# Altium schematic sheet Microcontroller.SchDoc: IMU Design
size A4; DrawnBy: Townsville Group 6; Revision: Final Submission; SheetNumber: 2; SheetTotal: 2
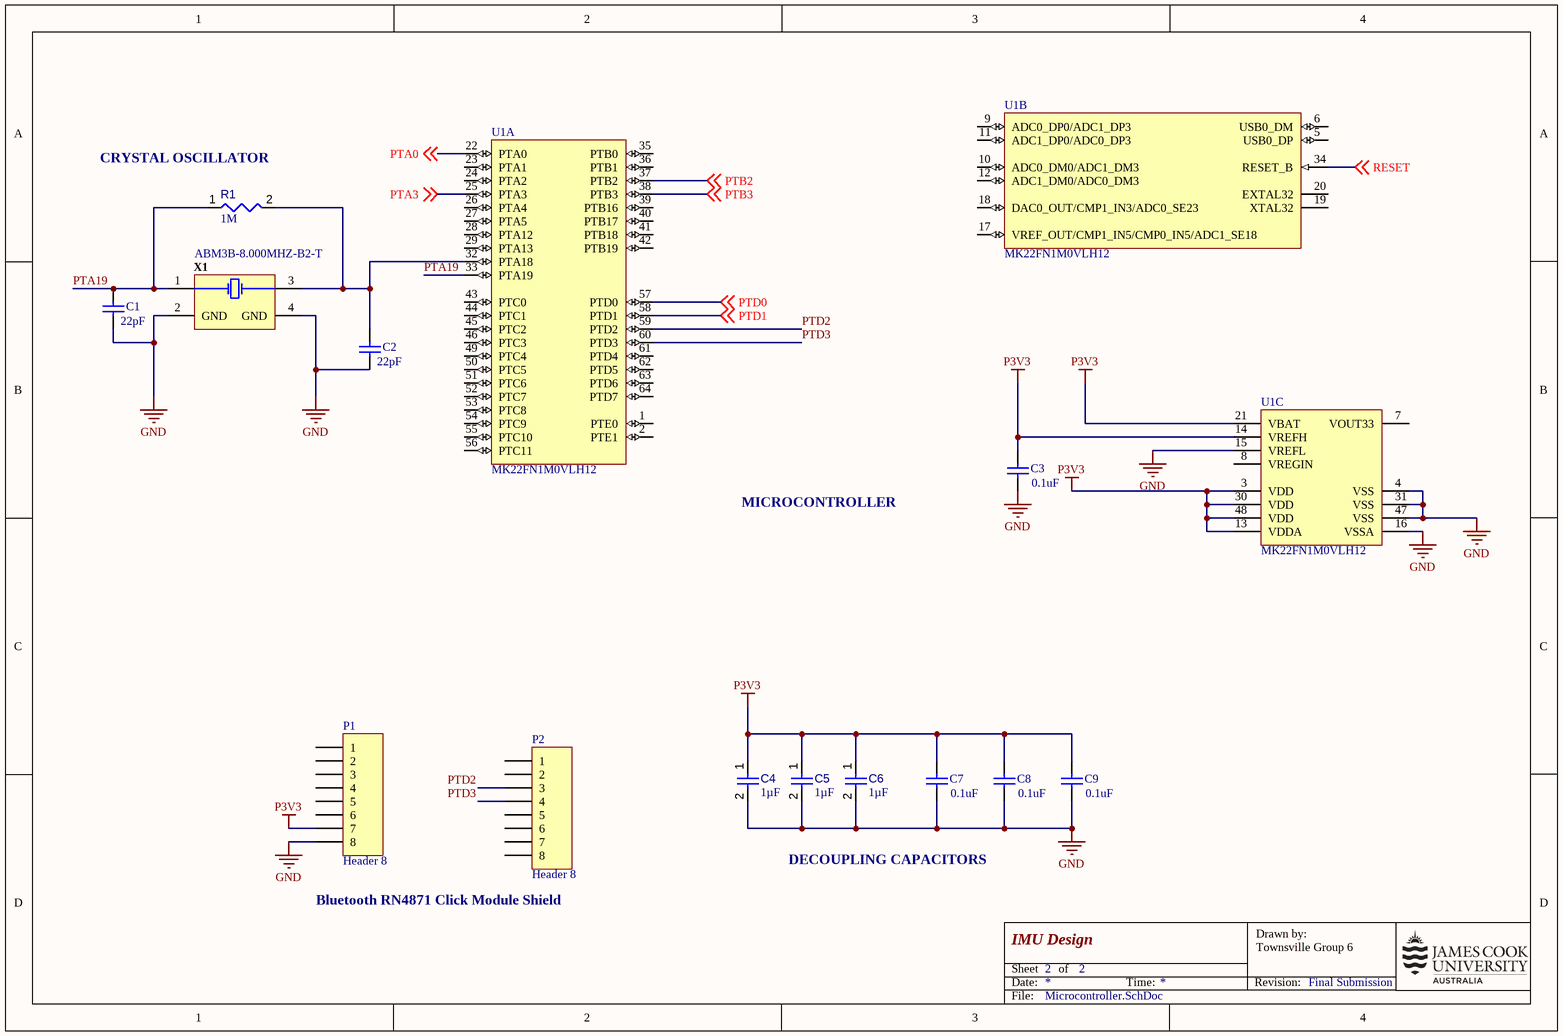
[diagram p0: Microcontroller.SchDoc]

## Parts
C1  22pF  [CAPC1206(3216)100_N]
C2  22pF  [CAPC1206(3216)100_N]
C3  0.1uF  [CAPC3216X95X55NL15T25]
C4  value 1µF  [CAPC3216X180X20ML20]  (hidden comment: Capacitor 1 uF +/- 10% 25 V 1206)
C5  value 1µF  [CAPC3216X180X20ML20]  (hidden comment: Capacitor 1 uF +/- 10% 25 V 1206)
C6  value 1µF  [CAPC3216X180X20ML20]  (hidden comment: Capacitor 1 uF +/- 10% 25 V 1206)
C7  0.1uF  [CAPC3216X95X55NL15T25]
C8  0.1uF  [CAPC3216X95X55NL15T25]
C9  0.1uF  [CAPC3216X95X55NL15T25]
P1  Header 8  [HDR1X8]
P2  Header 8  [HDR1X8]
R1  value 1M  [RESA60-630X240]  (hidden comment: MFR-25FBF52-1M)
U1  MK22FN1M0VLH12  [FREE-LQFP-64_M]  (parts A,B,C of 3)
X1  ABM3B-8.000MHZ-B2-T  [ABRA-ABM3B_V]

## Nets
GND: C1.1 C2.1 C3.2 C4.2 C5.2 C6.2 C7.1 C8.2 C9.2 P1.8 U1.4(VSS) U1.15(VREFL) U1.16(VSSA) U1.31(VSS) U1.47(VSS) X1.2(GND) X1.4(GND)
P3V3: C3.1 C4.1 C5.1 C6.1 C7.2 C8.1 C9.1 P1.7 U1.3(VDD) U1.13(VDDA) U1.14(VREFH) U1.21(VBAT) U1.30(VDD) U1.48(VDD)
PTA0: U1.22(PTA0) ; off-sheet PTA0
PTA3: U1.25(PTA3) ; off-sheet PTA3
PTA19: C1.2 R1.1 U1.33(PTA19) X1.1(X1)
PTB2: U1.37(PTB2) ; off-sheet PTB2
PTB3: U1.38(PTB3) ; off-sheet PTB3
PTD0: U1.57(PTD0) ; off-sheet PTD0
PTD1: U1.58(PTD1) ; off-sheet PTD1
PTD2: P2.3 U1.59(PTD2)
PTD3: P2.4 U1.60(PTD3)
RESET: U1.34(RESET_B) ; off-sheet RESET
NetC2_2: C2.2 R1.2 U1.32(PTA18) X1.3(X2)

Not connected (* = marked no-connect by the designer): P1 1 2 3 4 5 6; P2 1 2 5 6 7 8; U1 1(PTE0) 2(PTE1) 5(USB0_DP) 6(USB0_DM) 7(VOUT33) 8(VREGIN) 9(ADC0_DP0/ADC1_DP3) 10(ADC0_DM0/ADC1_DM3) 11(ADC1_DP0/ADC0_DP3) 12(ADC1_DM0/ADC0_DM3) 17(VREF_OUT/CMP1_IN5/CMP0_IN5/ADC1_SE18) 18(DAC0_OUT/CMP1_IN3/ADC0_SE23) 19(XTAL32) 20(EXTAL32) 23(PTA1) 24(PTA2) 26(PTA4) 27(PTA5) 28(PTA12) 29(PTA13) 35(PTB0) 36(PTB1) 39(PTB16) 40(PTB17) 41(PTB18) 42(PTB19) 43(PTC0) 44(PTC1) 45(PTC2) 46(PTC3) 49(PTC4) 50(PTC5) 51(PTC6) 52(PTC7) 53(PTC8) 54(PTC9) 55(PTC10) 56(PTC11) 61(PTD4) 62(PTD5) 63(PTD6) 64(PTD7)

## Notes on the sheet
- (near R1) CRYSTAL OSCILLATOR
- MICROCONTROLLER
- Bluetooth RN4871 Click Module Shield
- DECOUPLING CAPACITORS
- Date:
- Sheet
- of
- Time:
- Revision:
- Drawn by:
- File:

## Library data of the parts
C1 C2 = CMP-1037-00973-1: CAP 22pF 50V ±1% 1206 (3216 Metric) Thickness 1mm SMD; Tolerance: Â±1%; Case-Metric: 3216; Case-EIA: 1206; Technology: SMT; Rated Voltage: 50 V; Max Thickness: 1 mm; Value: 22pF
C3 C7-C9 = CMP-1662-00007-4: Chip Capacitor, 0.1 uF, +/- 10%, 50 V, -55 to 125 degC, 1206 (3216 Metric), RoHS, Tape and Reel; Manufacturer: Murata; Voltage Rating: 50 V; Lead Pitch: 4 mm; PackageDescription: 2-Pin Surface Mount Device, Body 3.2 x 1.6 mm; DatasheetVersion: 03/2016; Min Operating Temperature: -55 degC; Package Quantity: 4000; RoHSCompliant: true; Max Operating Temperature: 125 degC; Height: 0.85 mm; Pins: 2; Length: 3.2 mm; PackageReference: 1206 (3216 Metric); Mounting Technology: Surface Mount; ComponentLink1Description: Manufacturer URL; ComponentLink2Description: Datasheet; ComponentLink1URL: http://www.murata.com/; Mount: Surface Mount; REACH SVHC: No SVHC; Packaging: Tape and Reel; ComponentLink2URL: http://search.murata.co.jp/Ceramy/image/img/A01X/G101/ENG/GRM319R71H104KA01-01.pdf
C4-C6 = CMP-001-00006-4: Chip Capacitor, 1 uF, +/- 10%, 25 V, 1206 (3216 Metric); Voltage Rating: 25V; Capacitor Type: Ceramic; RoHS Compliant: True; Pins: 2; Min Operating Temperature: -55°C; Mounting Technology: SM; Max Operating Temperature: 125°C; Tolerance: 10%; Case/Package: 1206
P1 P2 = Header 8: Header, 8-Pin; LatestRevisionDate: 17-Jul-2002; LatestRevisionNote: Re-released for DXP Platform.; Publisher: Altium Limited
R1 = CMP-009-00049-3: Axial Resistor, 1 MOhm, +/- 1%, 250 mW, -55 to 155 degC, 2-Pin THD, RoHS, Bulk; Manufacturer: Yageo; Voltage Rating: 250V; Power: 250mW; Case/Package: Axial; Tolerance: 1%; Manufacturer URL: http://www.yageo.com/; Max Operating Temperature: 155°C; Datasheet URL: http://www.yageo.com/documents/recent/Yageo%20LR_MFR_2013.pdf; Package Description: 2-Pin Axial Lead, Dia 2.4 mm, Body Length 6.3 mm; Package Quantity: 200; Mounting Technology: TH; RoHS Compliant: True; Datasheet Version: Apr-13; Min Operating Temperature: -55°C; Packaging: Bulk; Package Reference: MFR-25
U1 = CMP-020-00010-2: Kinetis K22F Sub-Family, 120 MHz ARM(R) Cortex(R)-M4-based Microcontroller with FPU, 1.71 to 3.6 V, -40 to 105 degC, 64-Pin LQFP, RoHS, Tray; Manufacturer: Freescale; Min Supply Voltage: 1.71V; Interface: UART; Density: 1MB; RAM Size: 128KB; Max Supply Voltage: 3.6V; Max Clock Frequency: 120MHz; Package Version: Rev. G, 01/2016; Manufacturer URL: http://www.nxp.com/; Packaging: Tray; RoHS Compliant: True; Pins: 64; Case/Package: LQFP; Package URL: http://cache.nxp.com/files/shared/doc/package_info/98ASS23234W.pdf?fsrch=1&sr=1&pageNum=1; Datasheet URL: http://cache.nxp.com/files/32bit/doc/data_sheet/K22P64M120SF5.pdf; Package Quantity: 160; Package Description: 64-Pin Low-profile Quad Flat Package, Body 10 x 10 mm, Pitch 0.5 mm; Mounting Technology: SM; Max Operating Temperature: 105°C; Package Reference: LQFP-64; Min Operating Temperature: -40°C; Datasheet Version: Rev. 4, 11/2014
X1 = CMP-003-00021-1: Ceramic SMD Crystal, 8 MHz, +/- 20 ppm, 18 pF, -20 to 70 degC, 4-Pin SMD, RoHS, Tape and Reel; Manufacturer: Abracon; Resistance: 200Ohm; Frequency Tolerance: 20ppm; ESR: 200; Frequency: 8MHz; Load Capacitance: 18pF; Min Operating Temperature: -20°C; Package Reference: ABM3B; Pins: 4; Manufacturer URL: http://www.abracon.com/; Tolerance: 20ppm; Package Description: 4-Pin Surface Mount Device, Body 5 x 3.2 mm; Datasheet URL: http://www.abracon.com/Resonators/abm3b.pdf; Packaging: TapeandReel; RoHS Compliant: True; Case/Package: CSMD; Max Operating Temperature: 70°C; Mounting Technology: SM; Package Quantity: 1000; Datasheet Version: Aug-15